# Altium project Dummy_v.2.1.PrjPcb
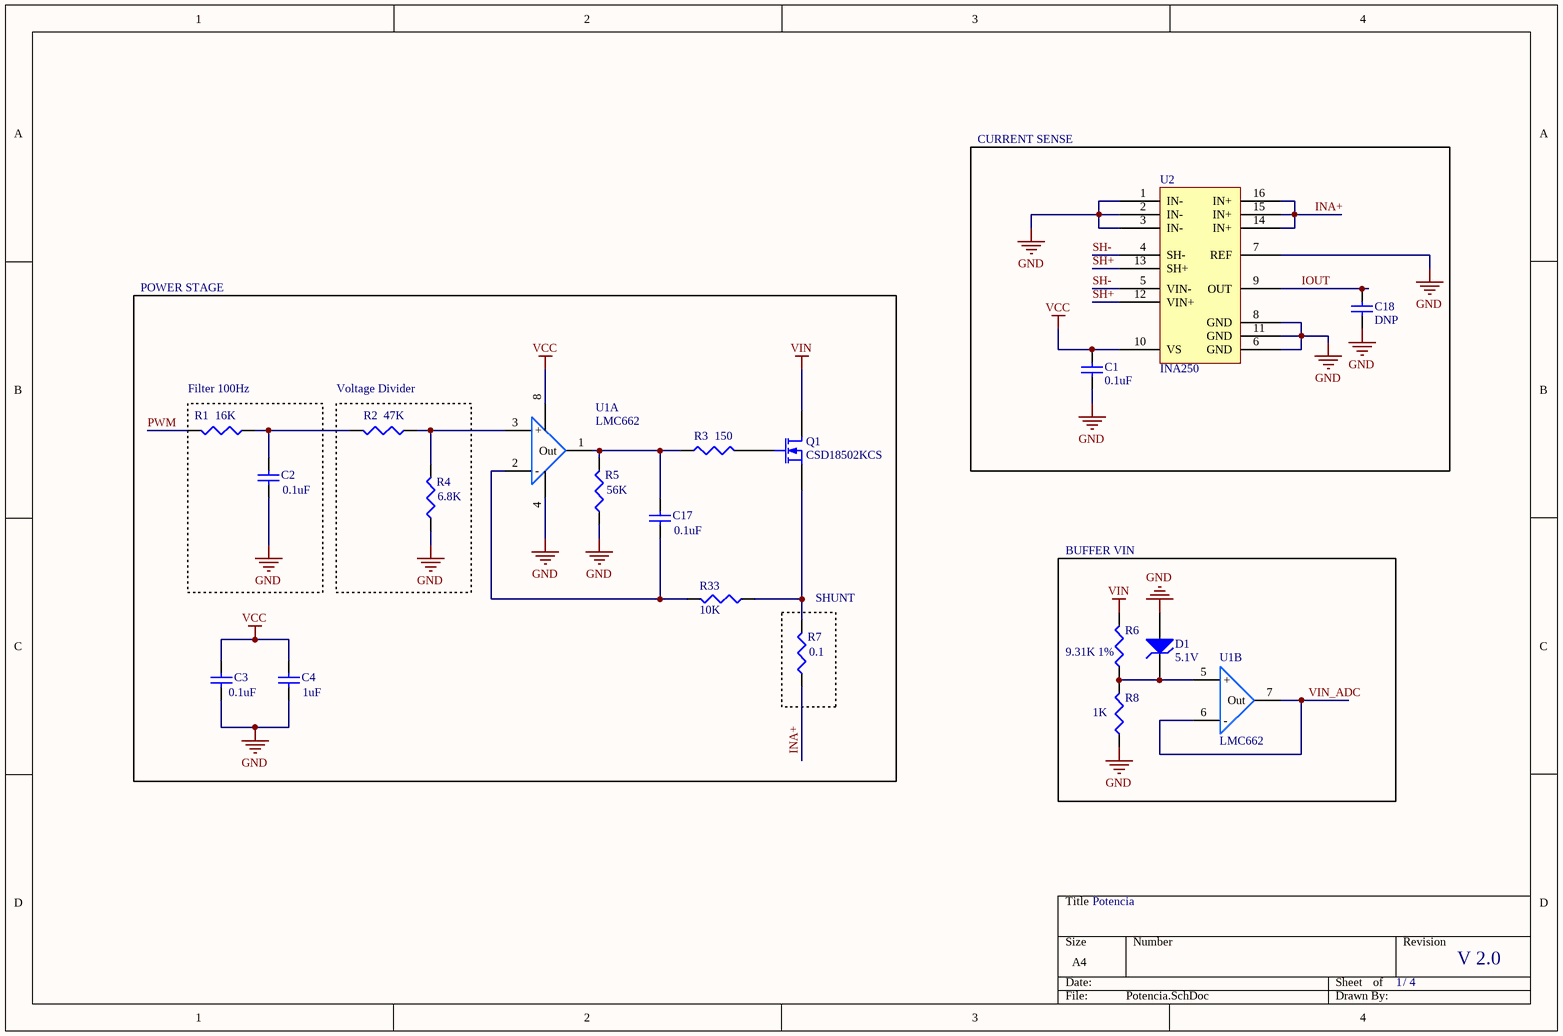
[diagram p0: Potencia.SchDoc]
3 sheets, 73 parts. Net scope: global (net labels, ports and power ports of the same name join across sheets).
Board file: Dummy_v2.1.PcbDoc
Sheets:
  Potencia.SchDoc
  UControl.SchDoc
  Alimentacion.SchDoc

## Sheet Potencia.SchDoc
size A4; Engineer: Triggerr; DocumentNumber: 3; Revision: V 2.0; SheetNumber: 1; SheetTotal: 4; DocumentName: Potencia

### Parts
(Parts that share a designator on the sheet are numbered #1, #2 ... from top to bottom, then left to right.)
C1  0.1uF  [C0805]
C2  value 0.1uF  [C0805]  (hidden comment: Cap)
C3  0.1uF  [C0805]
C4  value 1uF  [C0805]  (hidden comment: Cap)
C17  value 0.1uF  [C0805]  (hidden comment: Cap)
C18  DNP  [C0805]
D1#1  5.1V  [C1206]
Q1  CSD18502KCS  [TO-220AB]
R1  value 16K  [6-0805_N]  (hidden comment: Res)
R2  47K  [6-0805_N]
R3  value 150  [6-0805_N]  (hidden comment: Res)
R4  6.8K  [6-0805_N]
R5  56K  [6-0805_N]
R6  9.31K 1%  [6-0805_N]
R7  value 0.1  [RESC6332]  (hidden comment: Res)
R8  1K  [6-0805_N]
R33  10K  [6-0805_N]
U1  LMC662  [SOIC-OA8_N]  (parts A,B of 2)
U2  INA250  [TSSOP-ST16_N]

### Blocks framed on the sheet
CURRENT SENSE: C1 C18 U2
POWER STAGE: C3 C4 C17 Q1 R3 R5 R33 U1
Filter 100Hz: C2 R1
Voltage Divider: R2 R4
BUFFER VIN: D1#1 R6 R8 U1
SHUNT: R7

### Nets
GND: C1.1 C2.1 C3.2 C4.1 C18.1 D1#1.1(A) R4.1 R5.1 R8.1 U1.4(Vss) U2.1(IN-) U2.2(IN-) U2.3(IN-) U2.6(GND) U2.7(REF) U2.8(GND) U2.11(GND)
VCC: C1.2 C3.1 C4.2 U1.8(Vdd) U2.10(VS)
VIN: Q1.2(D) R6.2
INA+: R7.1 U2.14(IN+) U2.15(IN+) U2.16(IN+)
IOUT: C18.2 U2.9(OUT)
PWM: R1.2
SH+: U2.12(VIN+) U2.13(SH+)
SH-: U2.4(SH-) U2.5(VIN-)
VIN_ADC: U1.6(-) U1.7(Out)
NetC2_2: C2.2 R1.1 R2.2
NetC17_1: C17.1 R33.2 U1.2(-)
NetC17_2: C17.2 R3.1 R5.2 U1.1(Out)
NetD1#1_2: D1#1.2(K) R6.1 R8.2 U1.5(+)
NetQ1_1: Q1.1(G) R3.2
NetQ1_3: Q1.3(S) R7.2 R33.1
NetR2_1: R2.1 R4.2 U1.3(+)

### Notes on the sheet
- /

### Library data of the parts
C1 C2 C4 C17 = Cap: Capacitor; Published: 8-Jun-2000; LatestRevisionDate: 17-Jul-2002; LatestRevisionNote: Re-released for DXP Platform.; PackageReference: RAD-0.3; Publisher: Altium Limited; PackageDescription: Radial Cap, Thru-Hole; 2 Leads; 0.3 in Pin Spacing
  C1: Value: 0.1uF
C3 C18 = Cap: Capacitor; Value: 01.uF; Published: 8-Jun-2000; LatestRevisionDate: 17-Jul-2002; LatestRevisionNote: Re-released for DXP Platform.; PackageReference: RAD-0.3; Publisher: Altium Limited; PackageDescription: Radial Cap, Thru-Hole; 2 Leads; 0.3 in Pin Spacing
D1#1 = D Zener: Zener Diode; Published: 8-Jun-2000; LatestRevisionDate: 17-Jul-2002; LatestRevisionNote: Re-released for DXP Platform.; PackageReference: DIODE-0.7; Publisher: Altium Limited; PackageDescription: Diode, Thru-Hole; 2 Leads; 0.7 in Pin Spacing
Q1 = MOSFET-N: N-Channel MOSFET; Published: 8-Jun-2000; LatestRevisionDate: 17-Jul-2002; LatestRevisionNote: Re-released for DXP Platform.; PackageVersion: 1995/1996; PackageReference: E3; Publisher: Altium Limited; PackageDescription: TO, Flat Index; 3 In-Line, Axial Leads; Body Dia. 4.6mm; Lead Dia. 0.5 mm (max)
R1-R5 R7 R8 R33 = Res3: Resistor; Published: 8-Jun-2000; LatestRevisionDate: 29-May-2009; LatestRevisionNote: IPC-7351 Footprint Added.; PackageReference: J1-0603; Publisher: Altium Limited; PackageDescription: Chip Resistor
  R2: Value: 47K
  R4: Value: 6.8K
  R5: Value: 56K
  R33: Value: 10K
R6 = Res3: Resistor; Value: ??; Published: 8-Jun-2000; LatestRevisionDate: 29-May-2009; LatestRevisionNote: IPC-7351 Footprint Added.; PackageReference: J1-0603; Publisher: Altium Limited; PackageDescription: Chip Resistor

## Sheet UControl.SchDoc
size A4
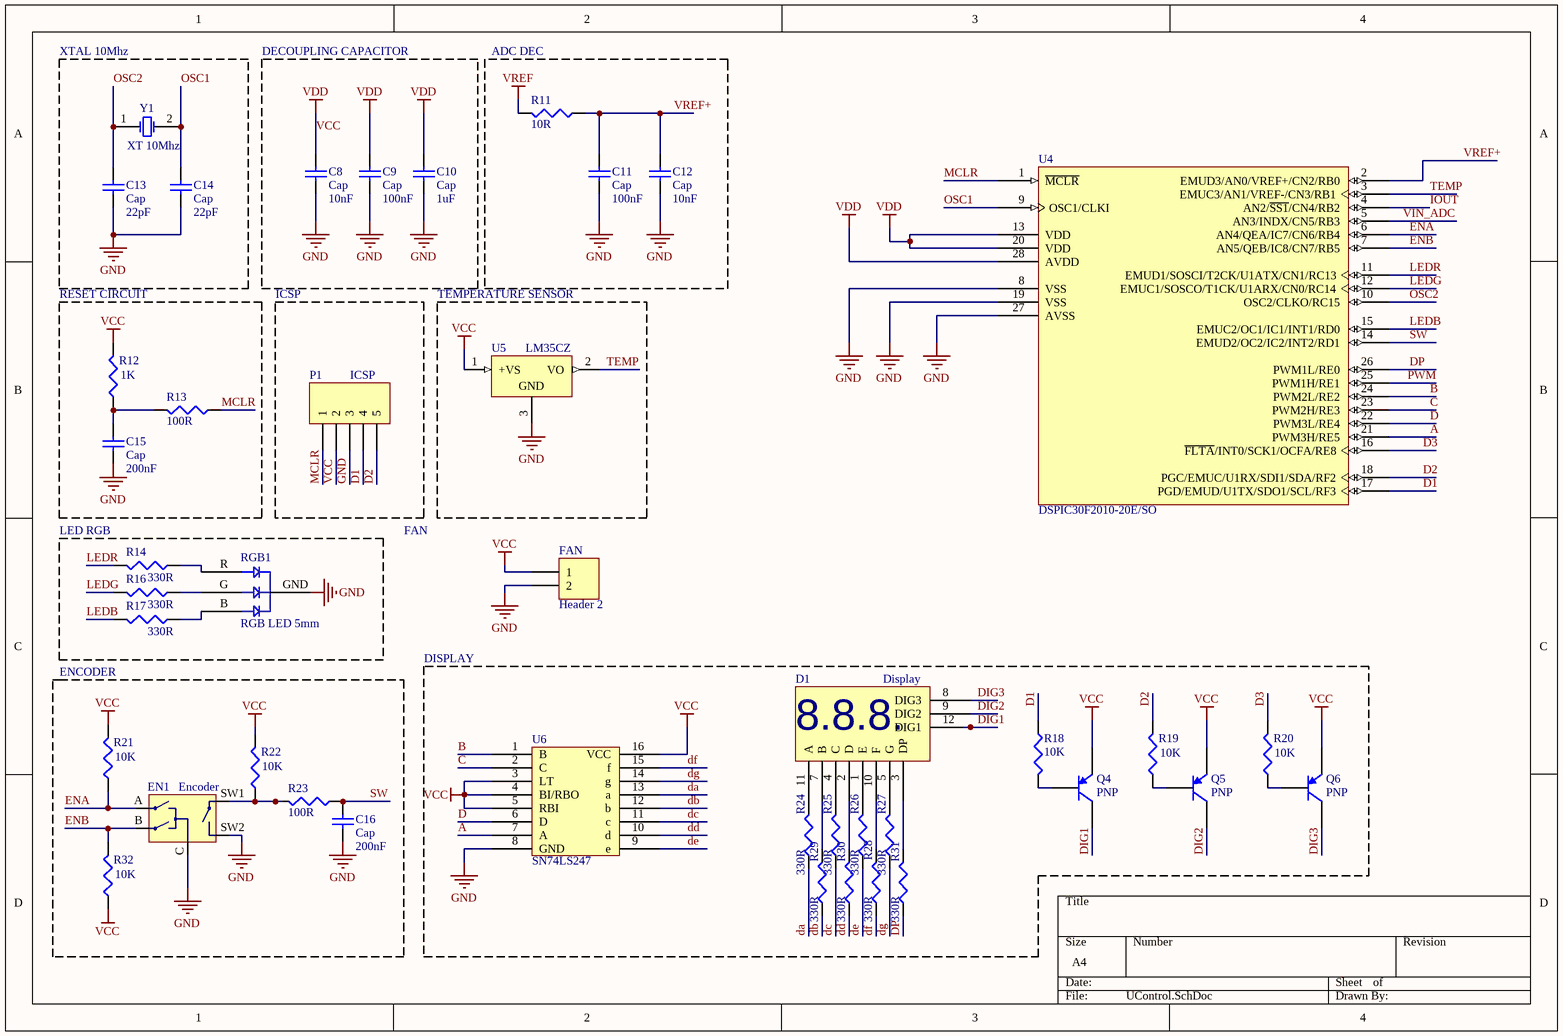
[diagram p1: UControl.SchDoc]

### Parts
(Parts that share a designator on the sheet are numbered #1, #2 ... from top to bottom, then left to right.)
C8  Cap  value 10nF  [C0805]
C9  Cap  value 100nF  [C0805]
C10  Cap  value 1uF  [C0805]
C11  Cap  value 100nF  [C0805]
C12  Cap  value 10nF  [C0805]
C13  Cap  value 22pF  [C0805]
C14  Cap  value 22pF  [C0805]
C15  Cap  value 200nF  [C0805]
C16  Cap  value 200nF  [C0805]
D1#2  Display  [0.36" 7 Segment]
EN1  Encoder  [ENCODER]
FAN  Header 2  [HDR1X2]
P1  ICSP  [HDR1X5]
Q4  PNP  [SOT-23B_N]
Q5  PNP  [SOT-23B_N]
Q6  PNP  [SOT-23B_N]
R11  value 10R  [6-0805_N]  (hidden comment: Res)
R12  value 1K  [6-0805_N]  (hidden comment: Res)
R13  value 100R  [6-0805_N]  (hidden comment: Res)
R14  value 330R  [6-0805_N]  (hidden comment: Res)
R16  value 330R  [6-0805_N]  (hidden comment: Res)
R17  value 330R  [6-0805_N]  (hidden comment: Res)
R18  value 10K  [6-0805_N]  (hidden comment: Res)
R19  value 10K  [6-0805_N]  (hidden comment: Res)
R20  value 10K  [6-0805_N]  (hidden comment: Res)
R21  value 10K  [6-0805_N]  (hidden comment: Res)
R22  value 10K  [6-0805_N]  (hidden comment: Res)
R23  value 100R  [6-0805_N]  (hidden comment: Res)
R24  value 330R  [6-0805_N]  (hidden comment: Res)
R25  value 330R  [6-0805_N]  (hidden comment: Res)
R26  value 330R  [6-0805_N]  (hidden comment: Res)
R27  value 330R  [6-0805_N]  (hidden comment: Res)
R28  value 330R  [6-0805_N]  (hidden comment: Res)
R29  value 330R  [6-0805_N]  (hidden comment: Res)
R30  value 330R  [6-0805_N]  (hidden comment: Res)
R31  value 330R  [6-0805_N]  (hidden comment: Res)
R32  value 10K  [6-0805_N]  (hidden comment: Res)
RGB1  RGB LED 5mm  [LED 5mm tri]
U4  DSPIC30F2010-20E/SO  [SOIC-SO28_N]
U5  LM35CZ  [Z03A]
U6  SN74LS247  [SOIC16-1.27 4mm]
Y1  XT 10Mhz  [HC49/4H_SMX]

### Blocks framed on the sheet
XTAL 10Mhz: C13 C14 Y1
DECOUPLING CAPACITOR: C8-C10
ADC DEC: C11 C12 R11
RESET CIRCUIT: C15 R12 R13
ICSP: P1
TEMPERATURE SENSOR: U5
LED RGB: R14 R16 R17 RGB1
DISPLAY: D1#2 Q4-Q6 R18-R20 R24-R31 U6
ENCODER: C16 EN1 R21-R23 R32

### Nets
GND: C8.1 C9.1 C10.1 C11.1 C12.1 C13.1 C14.1 C15.1 C16.1 EN1.C EN1.SW2 FAN.2 P1.3 RGB1.GND U4.8(VSS) U4.19(VSS) U4.27(AVSS) U5.3(GND) U6.8(GND)
VCC: C8.2 C9.2 C10.2 FAN.1 P1.2 Q4.2(E) Q5.2(E) Q6.2(E) R12.2 R21.2 R22.2 R32.1 U4.13(VDD) U4.20(VDD) U4.28(AVDD) U5.1(+VS) U6.3(LT) U6.4(BI/RBO) U6.5(RBI) U6.16(VCC)  [also labelled VDD]
VREF: R11.2
A: U4.21(PWM3H/RE5) U6.7(A)
B: U4.24(PWM2L/RE2) U6.1(B)
C: U4.23(PWM2H/RE3) U6.2(C)
D: U4.22(PWM3L/RE4) U6.6(D)
D1: P1.4 R18.1 U4.17(PGD/EMUD/U1TX/SDO1/SCL/RF3)
D2: P1.5 R19.2 U4.18(PGC/EMUC/U1RX/SDI1/SDA/RF2)
D3: R20.2 U4.16(~{FLTA}/INT0/SCK1/OCFA/RE8)
da: R24.1 U6.13(a)
db: R29.1 U6.12(b)
dc: R25.1 U6.11(c)
dd: R30.1 U6.10(d)
de: R26.1 U6.9(e)
df: R28.1 U6.15(f)
dg: R27.1 U6.14(g)
DIG1: D1#2.12(DIG1) Q4.3(C)
DIG2: D1#2.9(DIG2) Q5.3(C)
DIG3: D1#2.8(DIG3) Q6.3(C)
DP: R31.1 U4.26(PWM1L/RE0)
ENA: EN1.A R21.1 U4.6(AN4/QEA/IC7/CN6/RB4)
ENB: EN1.B R32.2 U4.7(AN5/QEB/IC8/CN7/RB5)
IOUT: U4.4(AN2/~{SS1}/CN4/RB2)
LEDB: R17.2 U4.15(EMUC2/OC1/IC1/INT1/RD0)
LEDG: R16.2 U4.12(EMUC1/SOSCO/T1CK/U1ARX/CN0/RC14)
LEDR: R14.2 U4.11(EMUD1/SOSCI/T2CK/U1ATX/CN1/RC13)
MCLR: P1.1 R13.1 U4.1(~{MCLR})
OSC1: C14.2 U4.9(OSC1/CLKI) Y1.2(OSC2)
OSC2: C13.2 U4.10(OSC2/CLKO/RC15) Y1.1(OSC1)
PWM: U4.25(PWM1H/RE1)
SW: C16.2 R23.1 U4.14(EMUD2/OC2/IC2/INT2/RD1)
TEMP: U4.3(EMUC3/AN1/VREF-/CN3/RB1) U5.2(VO)
VIN_ADC: U4.5(AN3/INDX/CN5/RB3)
VREF+: C11.2 C12.2 R11.1 U4.2(EMUD3/AN0/VREF+/CN2/RB0)
NetC15_2: C15.2 R12.1 R13.2
NetD1#2_1: D1#2.1(E) R26.2
NetD1#2_2: D1#2.2(D) R30.2
NetD1#2_3: D1#2.3(DP) R31.2
NetD1#2_4: D1#2.4(C) R25.2
NetD1#2_5: D1#2.5(G) R27.2
NetD1#2_7: D1#2.7(B) R29.2
NetD1#2_10: D1#2.10(F) R28.2
NetD1#2_11: D1#2.11(A) R24.2
NetEN1_SW1: EN1.SW1 R22.1 R23.2
NetQ4_1: Q4.1(B) R18.2
NetQ5_1: Q5.1(B) R19.1
NetQ6_1: Q6.1(B) R20.1
NetR14_1: R14.1 RGB1.R
NetR16_1: R16.1 RGB1.G
NetR17_1: R17.1 RGB1.B

### Notes on the sheet
- FAN
- (in symbol 0.36" 7 Segment Display 3 Digit Common Anode) 8.8.8.

### Library data of the parts
C8-C16 = Cap: Capacitor; Published: 8-Jun-2000; LatestRevisionDate: 17-Jul-2002; LatestRevisionNote: Re-released for DXP Platform.; PackageReference: RAD-0.3; Publisher: Altium Limited; PackageDescription: Radial Cap, Thru-Hole; 2 Leads; 0.3 in Pin Spacing
D1#2 = 0.36" 7 Segment Display 3 Digit Common Anode
FAN = Header 2: Header, 2-Pin; LatestRevisionDate: 17-Jul-2002; LatestRevisionNote: Re-released for DXP Platform.; Publisher: Altium Limited
P1 = Header 5: Header, 5-Pin; LatestRevisionDate: 17-Jul-2002; LatestRevisionNote: Re-released for DXP Platform.; Publisher: Altium Limited
Q4-Q6 = PNP: PNP Bipolar Transistor; Published: 8-Jun-2000; LatestRevisionDate: 29-May-2009; LatestRevisionNote: IPC-7351 Footprint Added.; PackageVersion: Aug-1999; PackageReference: SOT-23B; Publisher: Altium Limited; PackageDescription: 3-Pin SOT-23 Package 0.95 mm Pitch, 2.4 mm Lead Span
R11-R14 R16-R32 = Res3: Resistor; Published: 8-Jun-2000; LatestRevisionDate: 29-May-2009; LatestRevisionNote: IPC-7351 Footprint Added.; PackageReference: J1-0603; Publisher: Altium Limited; PackageDescription: Chip Resistor
U4 = DSPIC30F2010-20E/SO: High-Performance 16-bit Digital Signal Controller, 12 KB Flash, 512 Byte SRAM, 1 KB EEPROM, 28-Pin SOIC, Extended High Temperature; Published: 29-Jan-2009; DatasheetVersion: revH, May-2008; PackageVersion: revBB, Aug-2009; PackageReference: SOIC-SO28; Publisher: Altium Limited; PackageDescription: 28-Lead Plastic Small Outline (SO) - Wide 7.50mm Body [SOIC]; Supplier 1: Digi-Key; Supplier Part Number 1: DSPIC30F2010-20E/SO-ND; Code_JEDEC: MS-013; ComponentLink1Description: Datasheet; ComponentLink1URL: http://ww1.microchip.com/downloads/en/DeviceDoc/70118H.pdf; ComponentLink2Description: Packaging Specification; ComponentLink2URL: http://www.microchip.com/stellent/groups/techpub_sg/documents/packagingspec/en012702.pdf; ComponentLink3Description: Microchip.com Home; ComponentLink3URL: http://www.microchip.com/
U5 = LM35CZ: Precision Centigrade Temperature Sensor, 3-pin TO-92; Manufacturer: National Semiconductor; PackageTopMarking: NSXYTT*LM35*CZ; PowerWise: N; CompType: Temp Sensor IC; High-Reliability: Y; DatasheetVersion: Nov-2000; PackageVersion: revG, Sep-2000; PackageReference: Z03A; PackageDescription: TO-92, Molded, 3 Lead; PartNumber: LM35CZ; RoHS: N; PinCount: 3; Code_JEDEC: TO-226-AA; ComponentLink1Description: Manufacturer URL; ComponentLink1URL: http://www.national.com/; ComponentLink2Description: LM35 Datasheet; ComponentLink2URL: http://www.national.com/ds/LM/LM35.pdf; ComponentLink3Description: LM35 Web Page; ComponentLink3URL: http://www.national.com/pf/LM/LM35.html; ComponentLink4Description: Z03A Package Page; ComponentLink4URL: http://www.national.com/packaging/folders/z03a.html
Y1 = HC49/4H_SMX: Surface Mount Quartz Crystal; Note: PCB layout complies with manufacturer's recommendation.; Published: 17-Jul-2002; DatasheetDocument: 18-Oct-1999; PackageDocument: 18-Oct-1999; PackageReference: HC49/4H_SMX; Publisher: Altium Limited; ComponentLink1Description: Manufacturer Link; ComponentLink1URL: http://www.cmac.com/mt/; ComponentLink2Description: Datasheet; ComponentLink2URL: http://www.cmac.com/mt/databook/crystals/smd/hc49_4h_smx.pdf

## Sheet Alimentacion.SchDoc
size A4
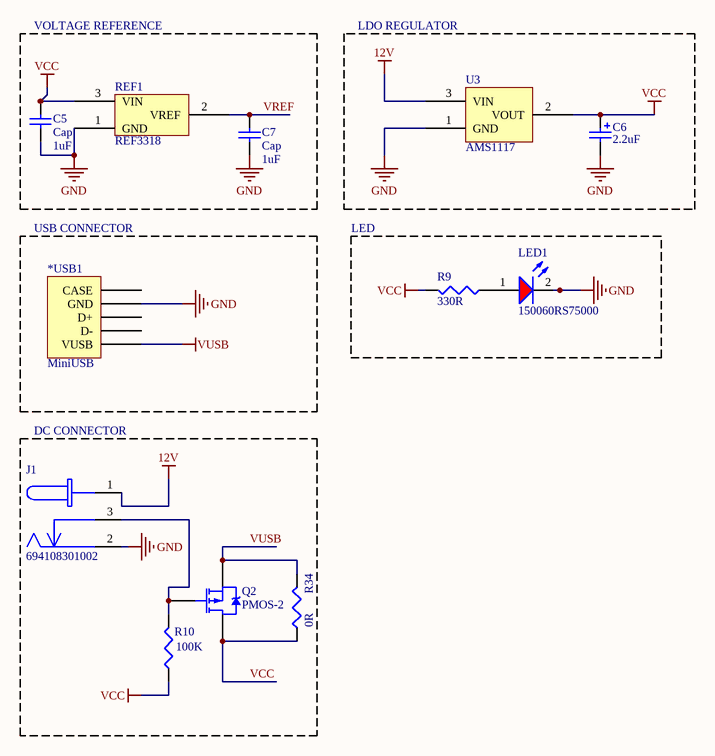
[diagram p2: Alimentacion.SchDoc]

### Parts
*USB1  MiniUSB  [Mini USB]
C5  Cap  value 1uF  [C0805]
C6  value 2.2uF  [C0805]  (hidden comment: CapPol)
C7  Cap  value 1uF  [C0805]
J1  694108301002  [694108301002]
LED1  150060RS75000  [LED_0603_Red]
Q2  PMOS-2  [SOT23_N]
R9  value 330R  [6-0805_N]  (hidden comment: Res)
R10  value 100K  [6-0805_N]  (hidden comment: Res)
R34  value 0R  [6-0805_N]  (hidden comment: Res)
REF1  REF3318  [SOT23_N]
U3  AMS1117  [SOT223_N]

### Blocks framed on the sheet
VOLTAGE REFERENCE: C5 C7 REF1
LDO REGULATOR: C6 U3
USB CONNECTOR: *USB1
LED: LED1 R9
DC CONNECTOR: J1 Q2 R10 R34

### Nets
12V: J1.1 U3.3(VIN)
GND: *USB1.2(GND) C5.1 C6.2 C7.1 J1.2 LED1.2(C) REF1.1(GND) U3.1(GND)
VCC: C5.2 C6.1 Q2.1(D) R9.2 R10.1 R34.1 REF1.3(VIN) U3.2(VOUT)
VREF: C7.2 REF1.2(VREF)
VUSB: *USB1.6(VUSB) Q2.2(S) R34.2
NetJ1_3: J1.3 Q2.3(G) R10.2
NetLED1_1: LED1.1(A) R9.1

Not connected (* = marked no-connect by the designer): *USB1 1(CASE) 4(D+) 5(D-)

### Library data of the parts
*USB1 = MiniUSB: KYOCERA  24 5141 005 000 863
C5 C7 = Cap: Capacitor; Published: 8-Jun-2000; LatestRevisionDate: 17-Jul-2002; LatestRevisionNote: Re-released for DXP Platform.; PackageReference: RAD-0.3; Publisher: Altium Limited; PackageDescription: Radial Cap, Thru-Hole; 2 Leads; 0.3 in Pin Spacing
J1 = 694108301002: WR-DC DC Power Jack Right Angled(6.4); Published: June 2016; Publisher: Wurth Elektronik; ComponentLink1Description: Manufacturer; ComponentLink1URL: http://www.we-online.de; ComponentLink2Description: Datasheet; ComponentLink2URL: http://katalog.we-online.de/em/datasheet/6941xx301002.pdf; PartNumber: 694108301002
LED1 = WL-SMCW 0603  150060RS75000: SMD mono-color Chip LED, WL-SMCW, Red; Manufacturer: W黵th Elektronik eiSos GmbH; PartNo: 150060RS75000; ComponentLink1Description: Manufacturer; ComponentLink1URL: http://www.we-online.de; Created by: Christin Otto; Created Date: June 2013; ComponentLink2Description: Datasheet; ComponentLink2URL: http://katalog.we-online.com/led/datasheet/150060RS75000.pdf; Color: Red
Q2 = PMOS-2: P-Channel Power MOSFET; Note: Pin 4 not drawn and electrically connected to Pin 2.; Published: 8-Jun-2000; LatestRevisionDate: 17-Jul-2002; LatestRevisionNote: Re-released for DXP Platform.; DatasheetVersion: PD-9.390D; PackageVersion: Feb-1997; PackageReference: TO-220AB; Publisher: Altium Limited; PackageDescription: TO, Thru-Hole, Vertical, Heatsink Mounted; 3 In-Line Leads; Pitch 2.54 mm; ComponentLink1Description: Manufacturer Link; ComponentLink1URL: http://www.irf.com/
R9 R10 R34 = Res3: Resistor; Published: 8-Jun-2000; LatestRevisionDate: 29-May-2009; LatestRevisionNote: IPC-7351 Footprint Added.; PackageReference: J1-0603; Publisher: Altium Limited; PackageDescription: Chip Resistor

## Nets that join several sheets
GND: Potencia (17 pins), UControl (19 pins), Alimentacion (8 pins)
VCC: Potencia (5 pins), UControl (20 pins), Alimentacion (8 pins)
VREF: UControl (R11.2), Alimentacion (C7.2 REF1.2)
IOUT: Potencia (C18.2 U2.9), UControl (U4.4)
PWM: Potencia (R1.2), UControl (U4.25)
VIN_ADC: Potencia (U1.6 U1.7), UControl (U4.5)